# EasyEDA Pro project new Led strip light pcb.eprj

# Schematic Schematic1
Board Name: Board1; Create Date: 2026-03-14; Page Name: P1; Project Name: new Led strip light; Schematic Name: Schematic1; Update Date: 2026-03-14; Company: EasyEDA.com; Page Size: A4; Version: V1.0
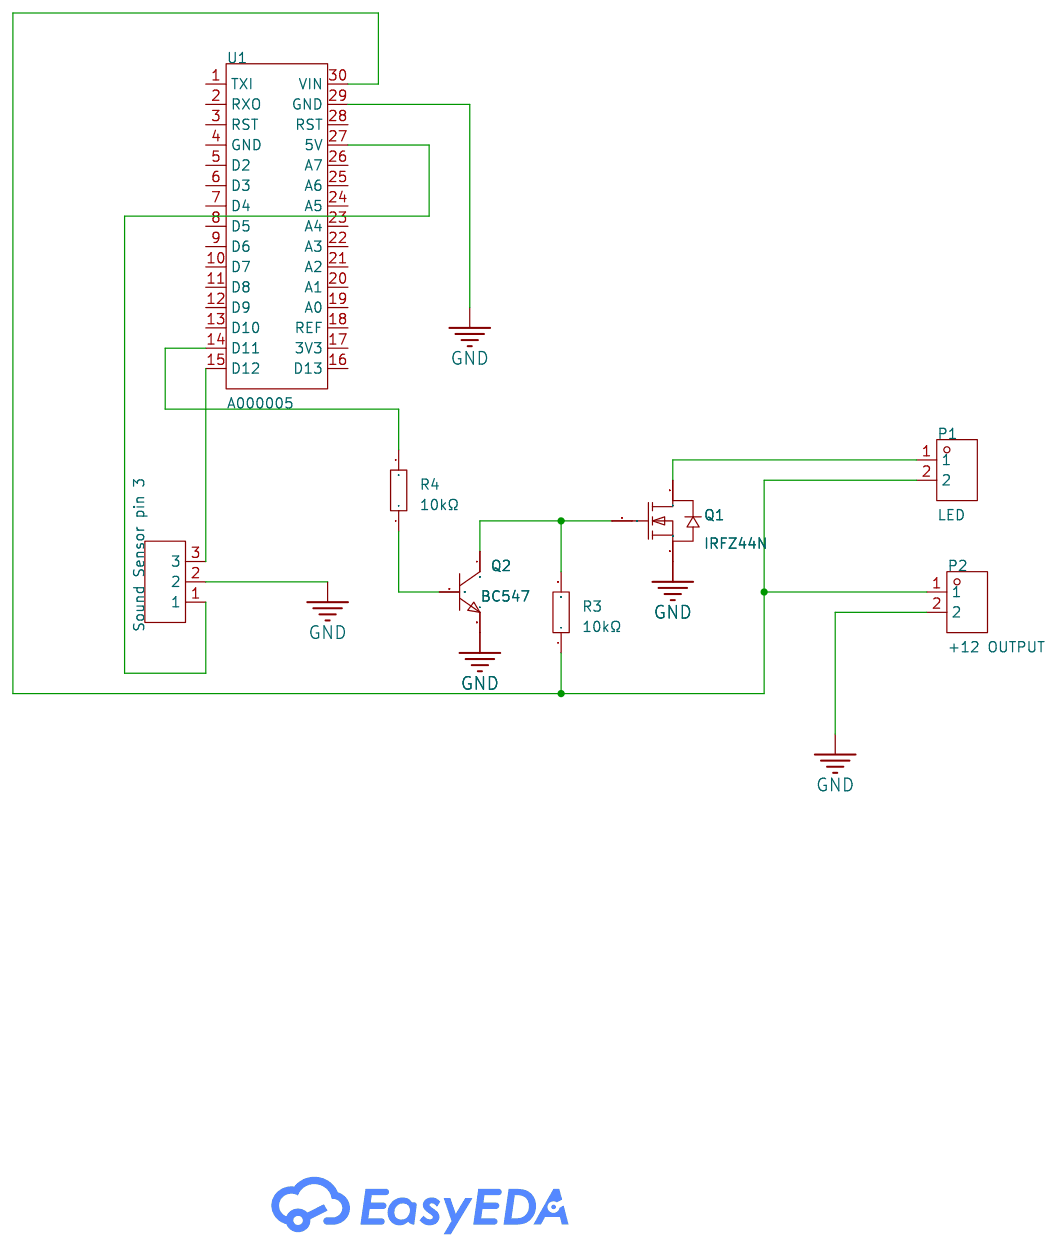
[diagram p0: schematic sheet]

## Parts
H1  Sound Sensor pin 3  [HDR-TH_3P-P2.54-V-M-1]
P1  LED  [CONN-TH_2P-P5.08_DIBO_DB129S-5.08-2P-GN-S]
P2  +12 OUTPUT  [CONN-TH_2P-P5.08_DIBO_DB129S-5.08-2P-GN-S]
Q1  IRFZ44N  [TO-220-3_L9.9-W4.5-P2.54-L]
Q2  BC547  [TO-92-3_L4.9-W3.7-P1.27-L]
R3  10kΩ  [R0402]
R4  10kΩ  [R0402]
U1  A000005  [COMM-TH_A000005]

## Library data of the parts
H1 = HX PH254-01-03-Z-L11.5 pcb pin header: LCSC Part Name: 1x3P 间距:2.54mm 方针 直插; Supplier Part: C52016391; Manufacturer: hanxia(韩下); Supplier Footprint: 插件,P=2.54mm; Datasheet: https://item.szlcsc.com/datasheet/HX%2520PH254-01-03-Z-L11.5%2520pcb%2520pin%2520header/54760436.html; Supplier: LCSC; Pin Structure: 1x3P; Pitch: 2.54mm; Circluar Pins/Square Pins: Pin Header; Mounting Type: Through Hole; Number of Rows: 1; Number of Pins: 3P; Current Rating: 3A; Voltage Rating (Max): 1kV; Length of Mating Pin: 6mm; Insulation Height: 2.5mm; Length of End Connection Pin: 3mm; Contact Material: Brass; Contact Plating: Gold; Operating Temperature: -40℃~+105℃
P1 P2 = DB129S-5.08-2P-GN-S: LCSC Part Name: 5.08mm 1x2P 排数:1 每排P数:2 直插; Supplier Part: C2909079; Manufacturer: DORABO(地博电气); Supplier Footprint: 插件,P=5.08mm; JLCPCB Part Class: Extended Part; Datasheet: https://atta.szlcsc.com/upload/public/pdf/source/20230106/EC9B49766E830D22E23422AB7723AD44.pdf; Supplier: LCSC; Structure: 1x2P; Pitch: 5.08mm; Color: Green; Mounting Style: Direct Insert; Number of Pins: 2P; Number of Rows: 1; Number of PINs Per Row: 2; Current Rating (Max): 20A; Voltage Rating (Max): 300V; Wire Gauge - AWG: 12~30; Wire Gauge - mm2: 0.2~2.5; Operating Temperature Range: -40℃~+105℃
Q1 = IRFZ44N: LCSC Part Name: 1个N沟道 耐压:60V 电流:60A; Supplier Part: C7429904; Manufacturer: minos(迈诺斯); Supplier Footprint: TO-220; Datasheet: https://item.szlcsc.com/datasheet/IRFZ44N/8428625.html; Supplier: LCSC; Number: 1 N-Channel; Drain to Source Voltage: 60V; Current - Continuous Drain(Id): 60A; RDS(on): 12mΩ@10V,25A; Pd - Power Dissipation: 87W; Gate Threshold Voltage (Vgs(th)@Id): 3V; Gate Charge(Qg): 31nC@10V; Input Capacitance(Ciss): 910pF@25V; Reverse Transfer Capacitance (Crss@Vds): 30pF@25V; Operating Temperature: -55℃~+175℃@(Tj)
Q2 = BC547: Supplier Part: C47089404; Manufacturer: CJ(江苏长电/长晶); Supplier Footprint: TO-92; JLCPCB Part Class: Extended Part; Datasheet: https://item.szlcsc.com/datasheet/BC547/49277194.html; Supplier: LCSC; type: NPN; Current - Collector(Ic): 100mA; Collector - Emitter Voltage VCEO: 45V; Pd - Power Dissipation: 625mW; DC Current Gain: 800@5V,2mA; Transition frequency(fT): 150MHz; Current - Collector Cutoff: 100nA; Vce Saturation(VCE(sat)): 300mV@100mA,5mA; Operating Temperature: -55℃~+150℃; Emitter-Base Voltage(Vebo): 6V; Number: 1 NPN
R3 R4 = RC0402FR-0710KL: LCSC Part Name: 厚膜电阻 10kΩ ±1% 62.5mW; Supplier Part: C60490; Manufacturer: YAGEO(国巨); Supplier Footprint: 0402; Datasheet: https://item.szlcsc.com/datasheet/RC0402FR-0710KL/61542.html; Supplier: LCSC; Type: Thick Film Resistor; Tolerance: ±1%; Power(Watts): 62.5mW; Voltage-Supply(Max): 50V; Temperature Coefficient: ±100ppm/℃; Operating Temperature: -55℃~+155℃
U1 = A000005: Supplier Part: C19189484; Manufacturer: arduino; JLCPCB Part Class: Extended Part; Datasheet: https://item.szlcsc.com/datasheet/A000005/20418063.html; Supplier: LCSC

## Nets
GND: H1.2 P2.2 Q1.3(S) Q2.3(E) U1.29(GND)
$1N919: P1.1 Q1.2(D)
$1N929: P1.2 P2.1 R3.1 U1.30(VIN)
$1N1002: R4.2 U1.14(D11)
$1N1007: Q2.2(B) R4.1
$1N1013: Q1.1(G) Q2.1(C) R3.2
$1N1173: H1.3 U1.15(D12)
$1N1433: H1.1 U1.27(5V)

Not connected (* = marked no-connect by the designer): U1 1(TXI) 2(RXO) 3(RST) 4(GND) 5(D2) 6(D3) 7(D4) 8(D5) 9(D6) 10(D7) 11(D8) 12(D9) 13(D10) 16(D13) 17(3V3) 18(REF) 19(A0) 20(A1) 21(A2) 22(A3) 23(A4) 24(A5) 25(A6) 26(A7) 28(RST)

# Board PCB1
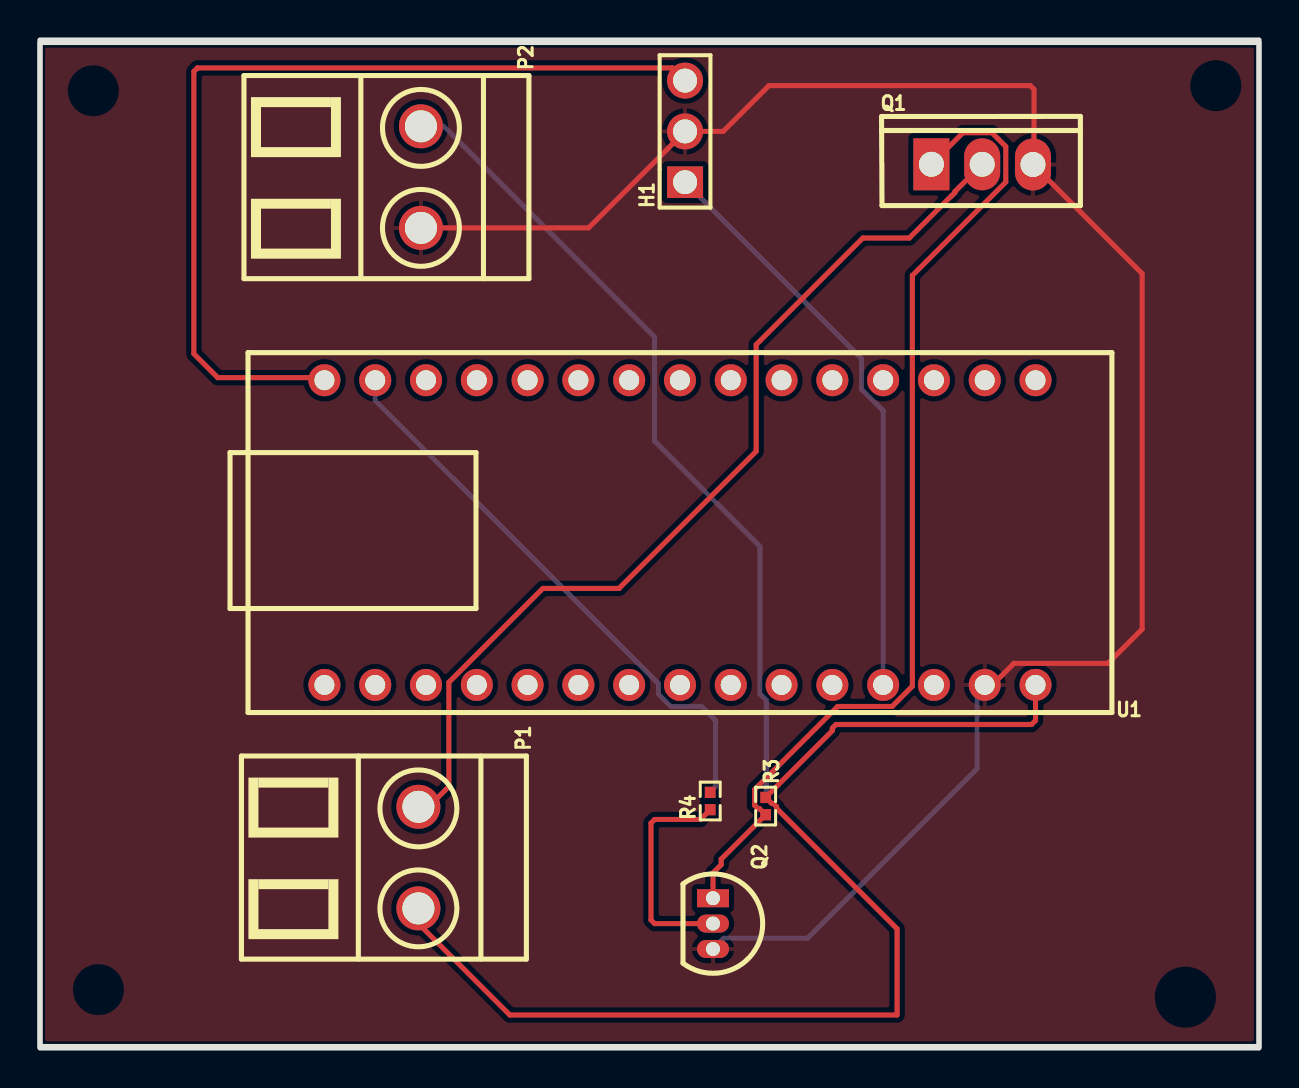
[diagram p1: board, top side]
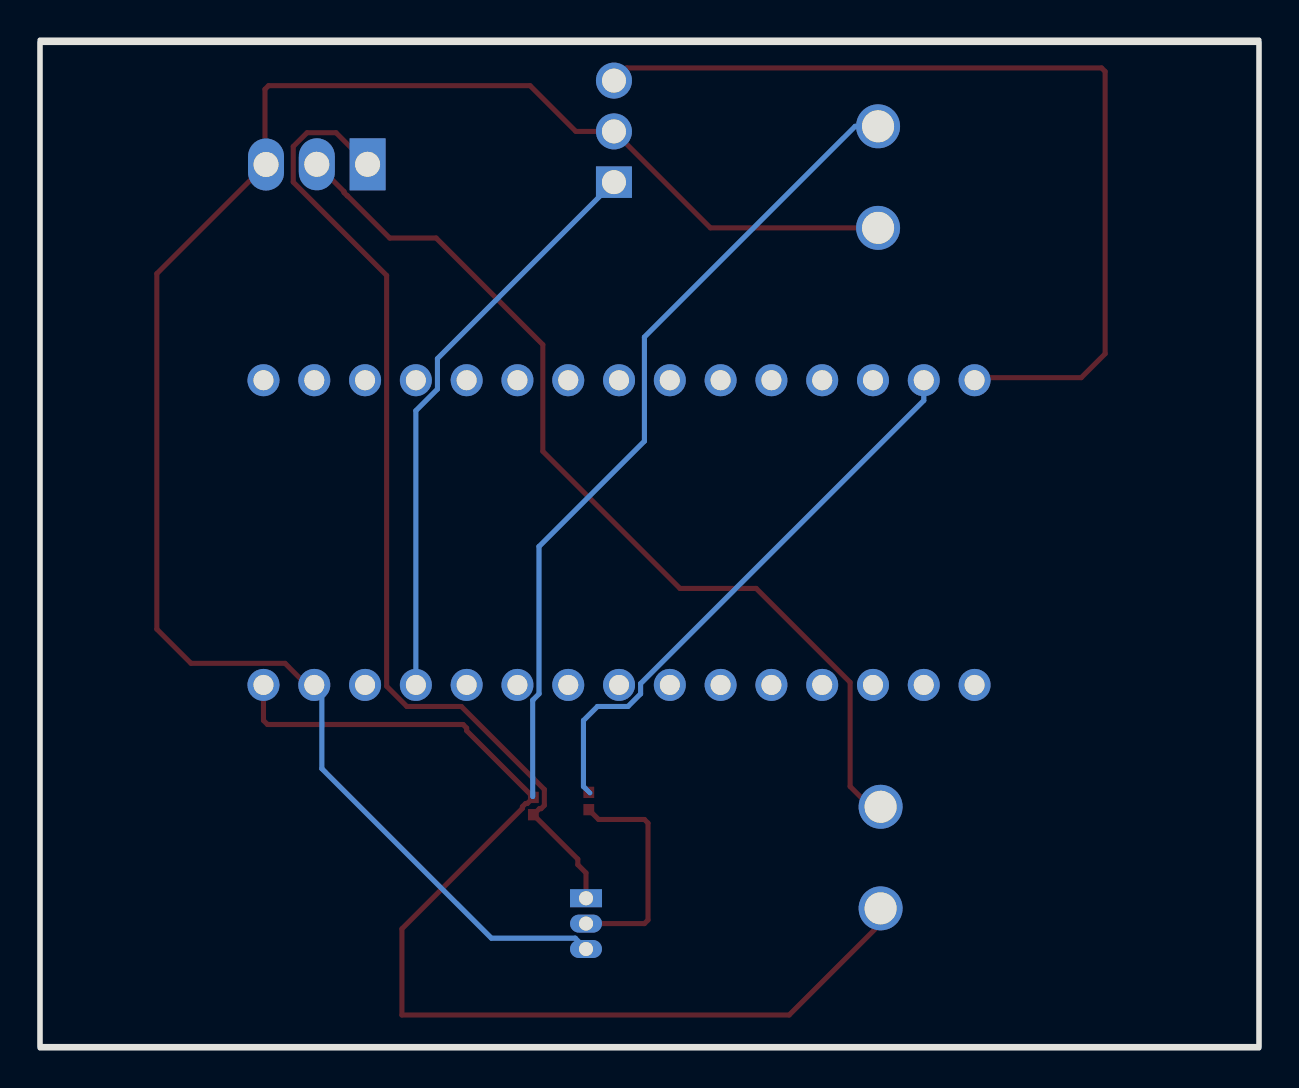
[diagram p2: board, bottom side, seen from below]

Outline 60.96 x 50.42 mm; copper layers: Top Layer, Bottom Layer. Coordinates in mm from the lower left corner of the outline.
Outline path: rectangle 0,50.42 60.96,0 ; rectangle 0,50.29 60.96,0.08
Stack: Top Layer 0.035mm / Dielectric1 1.51mm FR4 er 4.5 / Bottom Layer 0.035mm

## Design rules (mm)
template: JLCPCB Capability(Two Layers Board)
spacing copperThickness1oz (default): track to track 0.102, other pairs 0.152 to 0.3
spacing copperThickness2oz: track to track 0.203, other pairs 0.152 to 0.3
track width copperThickness1oz (default): min 0.127, default 0.254, max 2.54
track width copperThickness2oz: min 0.203, default 0.254, max 2.54
differential pair differentialPair (default): width min 0.127, default 0.254, max 2.54; gap min 0.152, default 0.152
via viaSize (default): diameter min 0.5, default 0.61, max 10; hole min 0.3, default 0.305, max 6.3

## Placement (name value [footprint] x y rotation side)
H1  Sound Sensor pin 3  [HDR-TH_3P-P2.54-V-M-1]  32.26 45.85 90 top
P1  LED  [CONN-TH_2P-P5.08_DIBO_DB129S-5.08-2P-GN-S]  18.92 9.52 270 top
P2  +12 OUTPUT  [CONN-TH_2P-P5.08_DIBO_DB129S-5.08-2P-GN-S]  19.05 43.56 270 top
Q1  IRFZ44N  [TO-220-3_L9.9-W4.5-P2.54-L]  47.12 44.2 0 top
Q2  BC547  [TO-92-3_L4.9-W3.7-P1.27-L]  33.66 6.22 270 top
R3  10kΩ  [R0402]  36.29 12.1 270 top
R4  10kΩ  [R0402]  33.52 12.35 90 top
U1  A000005  [COMM-TH_A000005]  32 25.78 180 top

## Footprints (pads in the part's own frame, mm; a bottom-side part is the same pattern mirrored in y, then rotated)
COMM-TH_A000005
  round 1.6 hole 1: 1(-17.78,-7.62) 2(-15.24,-7.62) 3(-12.7,-7.62) 4(-10.16,-7.62) 5(-7.62,-7.62) 6(-5.08,-7.62) 7(-2.54,-7.62) 8(0,-7.62) 9(2.54,-7.62) 10(5.08,-7.62) 11(7.62,-7.62) 12(10.16,-7.62) 13(12.7,-7.62) 14(15.24,-7.62) 15(17.78,-7.62) 16(17.78,7.62) 17(15.24,7.62) 18(12.7,7.62) 19(10.16,7.62) 20(7.62,7.62) 21(5.08,7.62) 22(2.54,7.62) 23(0,7.62) 24(-2.54,7.62) 25(-5.08,7.62) 26(-7.62,7.62) 27(-10.16,7.62) 28(-12.7,7.62) 29(-15.24,7.62) 30(-17.78,7.62)
CONN-TH_2P-P5.08_DIBO_DB129S-5.08-2P-GN-S
  round 2.2 hole 1.6: 1(-2.54,0) 2(2.54,0)
HDR-TH_3P-P2.54-V-M-1
  rect 1.575x1.8 hole 1.2: 1(-2.54,0)
  round 1.8 hole 1.2: 2(0,0) 3(2.54,0)
R0402
  rect 0.566x0.54 smd: 1(-0.433,0) 2(0.433,0)
TO-92-3_L4.9-W3.7-P1.27-L
  rect 0.9x1.6 hole 0.7: 1(-1.27,0)
  oval 0.9x1.6 hole 0.7: 2(0,0) 3(1.27,0)
TO-220-3_L9.9-W4.5-P2.54-L
  rect 1.8x2.6 hole 1.25: 1(-2.54,0.005)
  oval 1.8x2.6 hole 1.25: 2(0,0.005) 3(2.54,-0.005)

## Nets
As in the schematic.

Pads without a net: U1 1 2 3 4 5 6 7 8 9 10 11 12 13 16 17 18 19 20 21 22 23 24 25 26 28

## Routing (per net, layer and track width the routed paths; a pad name or vN(x,y) marks a point on that pad's centre or on a via; arc(x,y) is an arc through that point)
GND: length 93.1
  Top Layer w0.254: P2.2 27.43,41.02 H1.2 34.16,45.85 36.45,48.13 49.53,48.13 49.71,47.95 49.71,44.24 Q1.3 55.12,38.73 55.12,20.95 53.41,19.24 48.7,19.24 47.63,18.16 U1.29
  Bottom Layer w0.254: 46.86,18.16 46.86,13.97 38.39,5.49 34.2,5.49 Q2.3
$1N919: length 48.1
  Top Layer w0.254: Q1.2 45.76,42.84 45.76,42.79 45.59,42.62 45.58,42.62 43.47,40.51 41.15,40.51 35.81,35.18 35.81,29.84 28.96,22.99 25.14,22.99 20.45,18.29 20.45,13.08 18.8,11.43
$1N929: length 98.1
  Top Layer w0.254: 49.4,18.16 49.78,17.78 49.78,16.38 49.58,16.18 39.8,16.18 39.62,16 39.62,15.87 R3.1 36.59,12.23 36.67,12.23 36.84,12.07 36.84,11.99 42.86,5.96 42.86,1.65 23.49,1.65 18.8,6.35
  Bottom Layer w0.254: 36.32,12.57 36.32,17.4 36.01,17.71 36.01,25.08 30.73,30.35 30.73,35.56 20.19,46.1 P2.1
$1N1002: length 28.7
  Bottom Layer w0.254: 33.46,12.76 33.78,13.08 33.78,16.38 33.08,17.08 31.56,17.08 30.92,17.71 30.92,18.23 16.76,32.39 U1.14
$1N1007: length 11.3
  Top Layer w0.254: Q2.2 30.73,6.22 30.55,6.4 30.55,11.25 30.73,11.43 33.02,11.43 R4.1
$1N1013: length 50.4
  Top Layer w0.254: Q2.1 33.66,8.76 34.07,9.17 34.07,9.45 R3.2 35.98,11.97 35.9,11.97 35.74,12.14 35.74,12.93 39.89,17.08 42.61,17.08 43.63,18.1 43.63,38.64 48.3,43.31 48.3,45.09 47.61,45.78 46.16,45.78 Q1.1
$1N1173: length 46.1
  Top Layer w0.254: H1.3 31.62,49.02 7.87,49.02 7.69,48.84 7.69,34.72 8.89,33.53 14.1,33.53 U1.15
$1N1433: length 29.2
  Bottom Layer w0.254: U1.27 42.16,31.88 41.08,32.95 41.08,34.48 32.26,43.31

## Copper pours and planes (outline as drawn; the poured copper is in the pictures)
GND on Top Layer: 0.13,50.29 60.96,50.29 60.96,-0.13 0.13,-0.13
